# Altium schematic sheet Connector.SchDoc
size A4; Organization: Altium Limited; Address1: L3, 12a Rodborough Rd; Address2: Frenchs Forest; Address3: NSW; Address4: Australia 2086
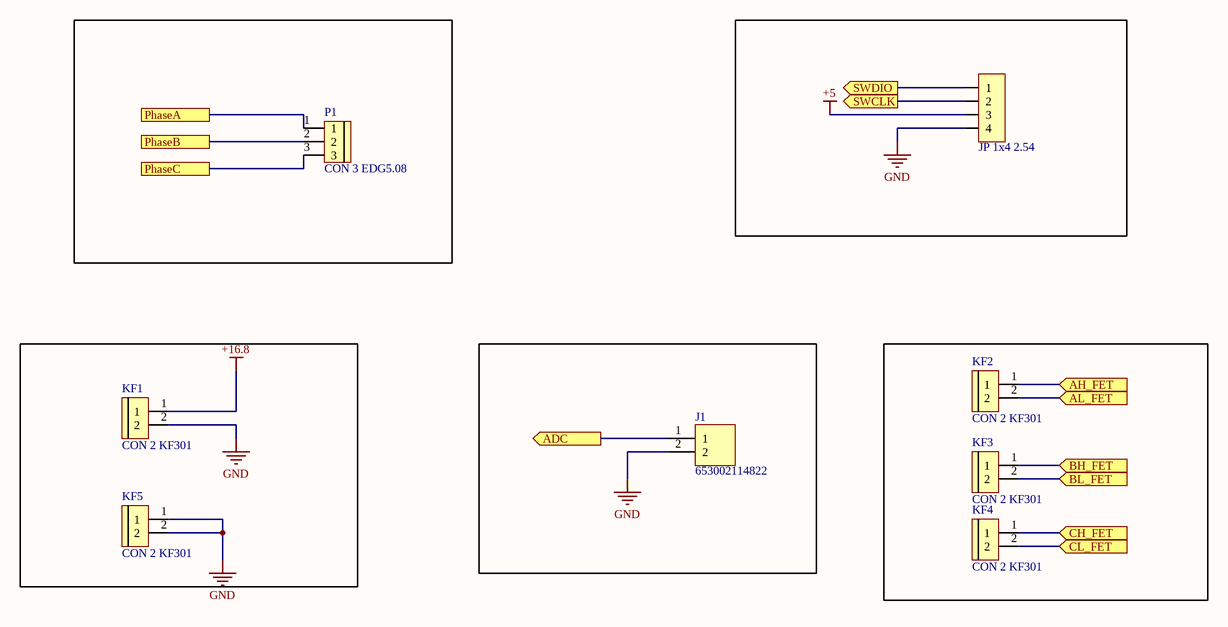
[diagram p0: Connector.SchDoc]

## Parts
J1  653002114822  [CON2_50_653002114822_TH_ST]
JP1  JP 1x4 2.54  [JP 1x4 DT]
KF1  CON 2 KF301  [Con 2 KF301 5.08]
KF2  CON 2 KF301  [Con 2 KF301 5.08]
KF3  CON 2 KF301  [Con 2 KF301 5.08]
KF4  CON 2 KF301  [Con 2 KF301 5.08]
KF5  CON 2 KF301  [Con 2 KF301 5.08]
P1  CON 3 EDG5.08  [CON 3 3EDG5.08]

## Ports
ADC (out), AH_FET (in), AL_FET (in), BH_FET (in), BL_FET (in), CH_FET (in), CL_FET (in), PhaseA, PhaseB, PhaseC, SWCLK (out), SWDIO (out)

## Nets
+5: JP1.3
+16.8: KF1.1
GND: J1.2 JP1.4 KF1.2 KF5.1 KF5.2
ADC: J1.1 ; port ADC
AH_FET: KF2.1 ; port AH_FET
AL_FET: KF2.2 ; port AL_FET
BH_FET: KF3.1 ; port BH_FET
BL_FET: KF3.2 ; port BL_FET
CH_FET: KF4.1 ; port CH_FET
CL_FET: KF4.2 ; port CL_FET
PhaseA: P1.1 ; port PhaseA
PhaseB: P1.2 ; port PhaseB
PhaseC: P1.3 ; port PhaseC
SWCLK: JP1.2 ; port SWCLK
SWDIO: JP1.1 ; port SWDIO

## Notes on the sheet
- Title
- Size:
- Date:
- A4
- Number:
- Time:
- Revision:
- Sheet
- of
- File:

## Library data of the parts
J1 = CON-PLG_2X1-50-ST-TH: 2 Pins, 1 Row 1.25mm Pitch, Straight Connector, male; Manufacturer: JST; Mating Part Number: 653002113322; Crimp Part Number: 653153128130; Alternate Part Number-1: NA; Manufacturer Part Number: 653002114822; Case/Package: TH-CON; Supplier-1: WURTH; Supplier Part Number-1: 653002114822
JP1 = JP 1x4 2.54 Duc Thang: Cắm; Ten_Linh_Kien: Jump Đơn Đực 2.54MM 1x40P Thẳng 11MM; Don_Vi: Con; Ma_Hang: MH000903; Ghi_Chu: *; Kieu_Chan: *; Chung_Loai: Cắm
KF1-KF5 = CON 2 KF301: Cắm; Ma_Hang: MH000987; Ten_Linh_Kien: CON 2 KF301-2P 5.08MM Xanh Dương; Chung_Loai: Cắm; Ghi_Chu: *; Kieu_Chan: *; Don_Vi: Con
P1 = CON 3 EDG5.08: Cắm; Ten_Linh_Kien: CON 3 2EDG5.08-3P 5.08MM ( Xanh Cong); Ma_Hang: MH000760; Ghi_Chu: *; Kieu_Chan: *; Don_Vi: Con; Chung_Loai: Cắm